# EAGLE design sensor_IZQ_Y_DER (EAGLE 5.11)
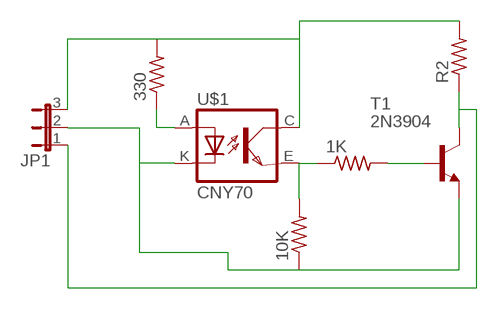
[diagram p0: schematic, sheet 1]

## Parts
1K  R-US_0309/10  [0309/10]
10K  R-US_0309/10  [0309/10]
330  R-US_0309/10  [0309/10]
JP1  JP2E  [JP2]
R2  R-US_0309/10  [0309/10]
T1  2N3904  [TO92]
U$1  CNY70  [4]

## Nets
N$1: 330.2 JP1.3 R2.2 U$1.C(COL)
N$2: 10K.1 JP1.2 T1.3(E) U$1.K(C)
N$3: 1K.2 T1.2(B)
N$4: 1K.1 10K.2 U$1.E(EMI)
N$5: 330.1 U$1.A
N$6: JP1.1 R2.1 T1.1(C)

## Library data of the parts
1K 10K 330 R2 = rcl:R-US_: RESISTOR, American symbol
JP1 = jumper:JP2E: JUMPER
T1 = transistor:2N3904: NPN TRANSISTOR
U$1 = cny70:CNY70

## Board
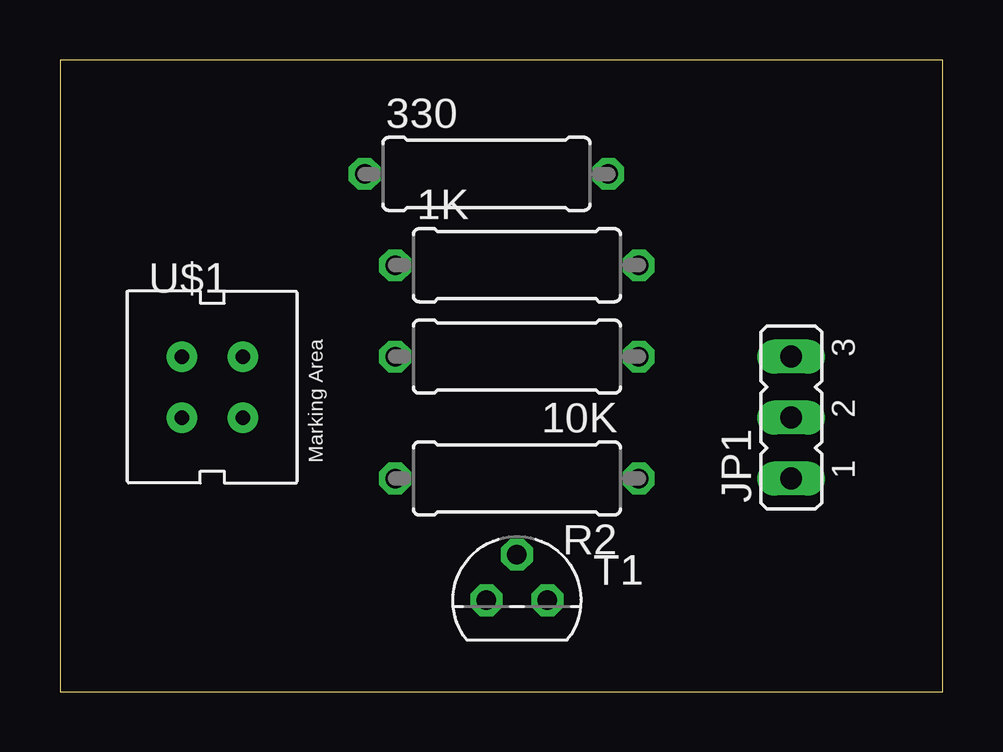
[diagram p1: board, top side]
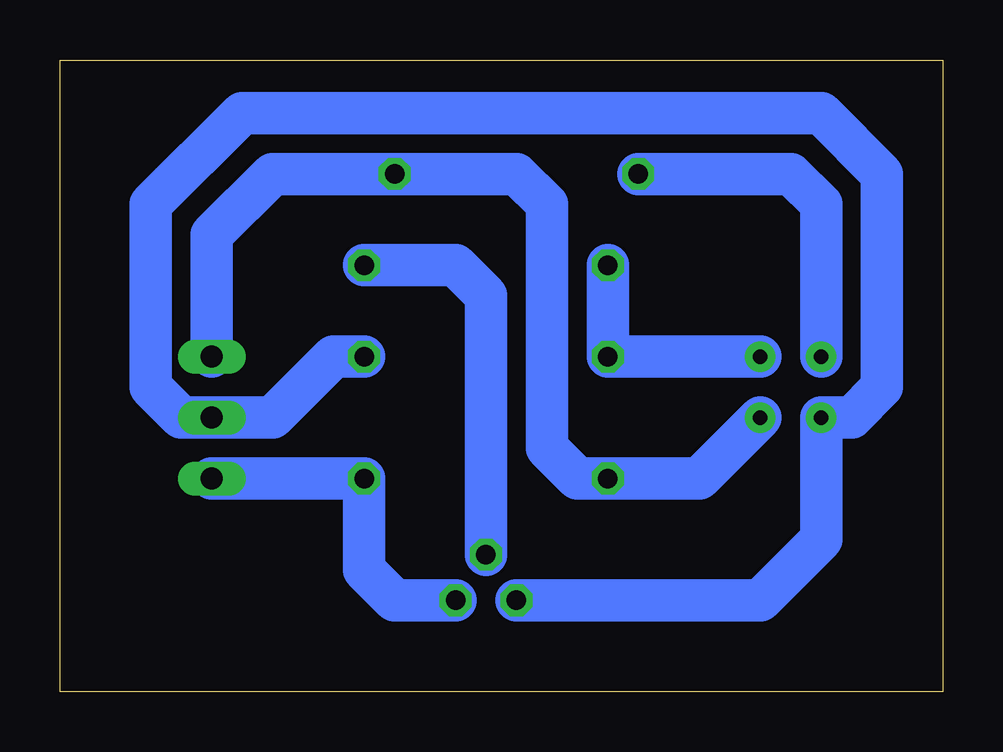
[diagram p2: board, bottom side, seen from below]

Size 36.81 x 26.34 mm. Coordinates in mm from the lower left corner, seen from the top.
Outline: 0,0 36.81,0 36.81,26.34 0,26.34 0,0
Copper layers (1*16): Top 0.035mm / dielectric 1.5mm / Bottom 0.035mm
Design rules "default": minimum track width 10mil, minimum drill 24mil, track to track 8mil, track to pad 8mil, pad to pad 8mil, via to via 8mil, smd to smd 8mil, copper to edge 40mil, drill to drill 8mil, minimum pad ring 10mil, minimum via ring 8mil, stop-mask expansion 4mil, vias tented up to drill 0mil, thermal gap 10mil

### Footprints (pad centres in the part's own frame; a part is rotated, then mirrored left to right if it is on the bottom)
0309/10 = drill 0.813 octagon: 1 -5.08,0; 2 5.08,0
JP2 = drill 0.914 long: 1 -2.54,0; 2 0,0; 3 2.54,0
TO92 = drill 0.813 octagon: 1 1.27,0; 2 0,1.905; 3 -1.27,0
4 = drill 0.61 pad 1.27: A -1.27,1.27; C 1.27,-1.27; E 1.27,1.27; K -1.27,-1.27

### Placement (x,y rotation side)
1K  19.05,17.78 0 top
10K  19.05,13.97 180 top
330  17.78,21.59 0 top
JP1  30.48,11.43 90 top
R2  19.05,8.89 180 top
T1  19.05,3.81 0 top
U$1  6.35,12.7 0 top

### Tracks (layer width: path | path; a pad name or v marks a point on that pad's centre or on a via)
N$1
  Bottom 1.778: U$1.C 10.16,8.89 R2.2 15.24,8.89 16.51,10.16 16.51,20.32 17.78,21.59 330.2 27.94,21.59 30.48,19.05 JP1.3
N$2
  Bottom 1.778: T1.3 7.62,3.81 5.08,6.35 U$1.K 3.81,11.43 2.54,12.7 2.54,21.59 5.08,24.13 29.21,24.13 33.02,20.32 33.02,12.7 31.75,11.43 JP1.2 27.94,11.43 25.4,13.97 10K.1
N$3
  Bottom 1.778: T1.2 19.05,16.51 20.32,17.78 1K.2
N$4
  Bottom 1.778: 1K.1 10K.2 U$1.E
N$5
  Bottom 1.778: U$1.A 5.08,20.32 6.35,21.59 330.1
N$6
  Bottom 1.778: T1.1 22.86,3.81 24.13,5.08 R2.1 JP1.1
N$7
  pour Bottom (isolate 6.452): 36.83,26.67 36.83,0 0,0 0,26.67